# EAGLE design 2LCI2C (EAGLE 9.6.2)
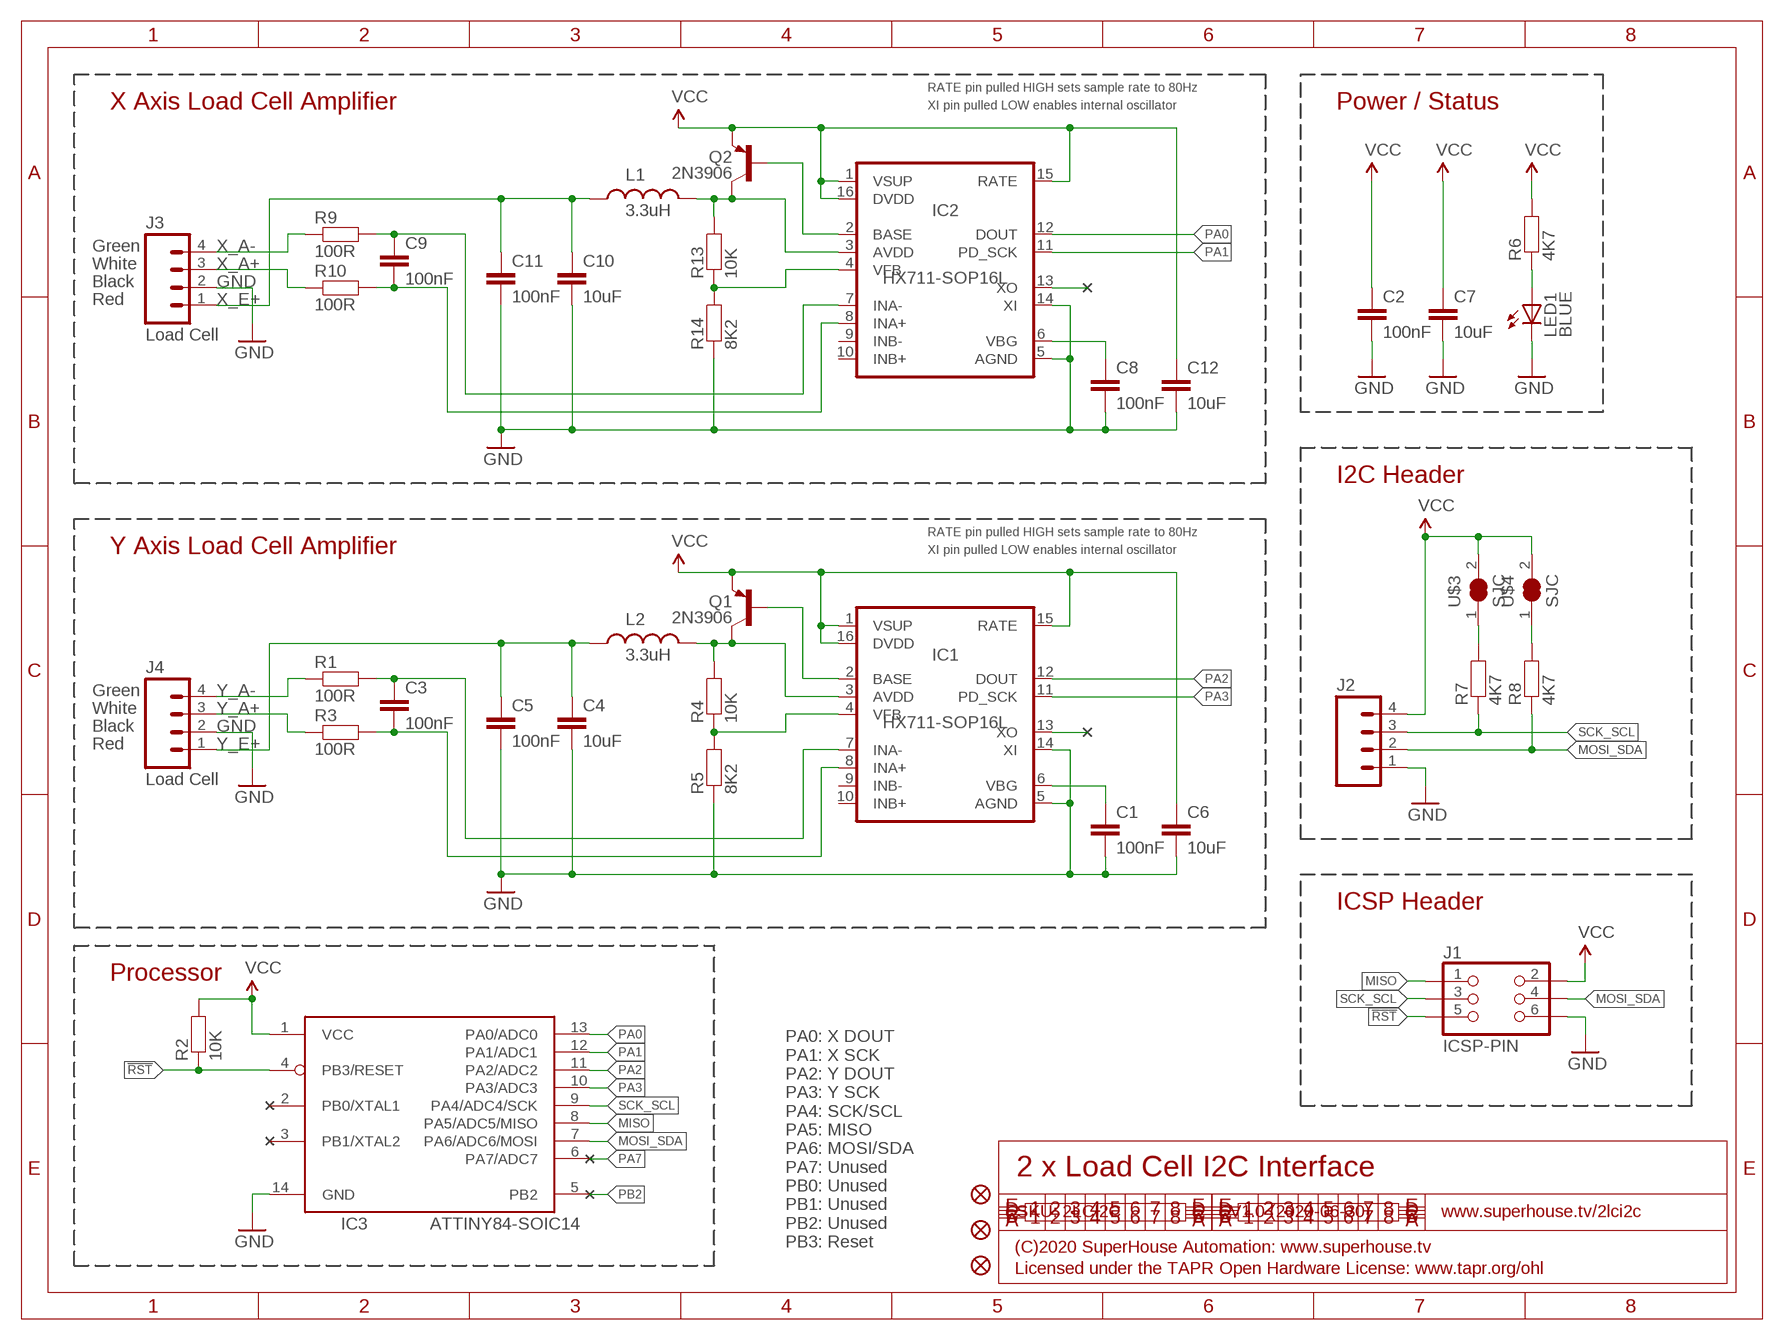
[diagram p0: schematic, sheet 1]

## Parts
C1  100nF  CAP0603  [C0603]
C2  100nF  CAP0603  [C0603]
C3  100nF  CAP0603  [C0603]
C4  10uF  CAP0805  [C0805]
C5  100nF  CAP0603  [C0603]
C6  10uF  CAP0805  [C0805]
C7  10uF  CAP0805  [C0805]
C8  100nF  CAP0603  [C0603]
C9  100nF  CAP0603  [C0603]
C10  10uF  CAP0805  [C0805]
C11  100nF  CAP0603  [C0603]
C12  10uF  CAP0805  [C0805]
IC1  HX711-SOP16L  [SOP16-L]
IC2  HX711-SOP16L  [SOP16-L]
IC3  ATTINY84-SOIC14  [SOIC14]
J1  ICSP-PIN  [2X03-ICSP]
J2  M04-PLAIN  [1X04]
J3  Load Cell  M04-1.27-PLAIN  [1X04-1.27-PLAIN]
J4  Load Cell  M04-1.27-PLAIN  [1X04-1.27-PLAIN]
L1  3.3uH  INDUCTOR0603  [L0603]
L2  3.3uH  INDUCTOR0603  [L0603]
LED1  BLUE  LED0603  [LED-0603]
Q1  2N3906  TRANS_PNPMMBT3906LT1SOT23-BEC  [SOT23-BEC]
Q2  2N3906  TRANS_PNPMMBT3906LT1SOT23-BEC  [SOT23-BEC]
R1  100R  RESISTOR0603  [R0603]
R2  10K  RESISTOR0603  [R0603]
R3  100R  RESISTOR0603  [R0603]
R4  10K  RESISTOR0603  [R0603]
R5  8K2  RESISTOR0603  [R0603]
R6  4K7  RESISTOR0603  [R0603]
R7  4K7  RESISTOR0603  [R0603]
R8  4K7  RESISTOR0603  [R0603]
R9  100R  RESISTOR0603  [R0603]
R10  100R  RESISTOR0603  [R0603]
R13  10K  RESISTOR0603  [R0603]
R14  8K2  RESISTOR0603  [R0603]
U$3  SJC  SJC-NORMAL  [SJC]
U$4  SJC  SJC-NORMAL  [SJC]
U$5  FIDUCIAL1X2.5  [FIDUCIAL-1X2.5]
U$10  FIDUCIAL1X2.5  [FIDUCIAL-1X2.5]
U$11  FIDUCIAL1X2.5  [FIDUCIAL-1X2.5]

## Nets
!RST: IC3.4(PB3/RESET) J1.5 R2.1
GND: C1.2 C2.2 C4.2 C5.2 C6.2 C7.2 C8.2 C10.2 C11.2 C12.2 IC1.5(AGND) IC1.14(XI) IC2.5(AGND) IC2.14(XI) IC3.14(GND) J1.6 J2.1 J3.2 J4.2 LED1.C R5.1 R14.1
MISO: IC3.8(PA5/ADC5/MISO) J1.1
MOSI_SDA: IC3.7(PA6/ADC6/MOSI) J1.4 J2.2 R8.1
N$1: C3.1 IC1.7(INA-) R1.2
N$2: C3.2 IC1.8(INA+) R3.2
N$3: C1.1 IC1.6(VBG)
N$4: IC1.2(BASE) Q1.B
N$5: LED1.A R6.1
N$6: IC1.4(VFB) R4.1 R5.2
N$7: IC1.3(AVDD) L2.2 Q1.C R4.2
N$8: IC2.13(XO)
N$9: IC1.13(XO)
N$11: R7.2 U$3.1
N$12: R8.2 U$4.1
N$14: C9.1 IC2.7(INA-) R9.2
N$15: C9.2 IC2.8(INA+) R10.2
N$16: IC2.3(AVDD) L1.2 Q2.C R13.2
N$17: C8.1 IC2.6(VBG)
N$20: IC2.2(BASE) Q2.B
N$21: IC2.4(VFB) R13.1 R14.2
PA0: IC2.12(DOUT) IC3.13(PA0/ADC0)
PA1: IC2.11(PD_SCK) IC3.12(PA1/ADC1)
PA2: IC1.12(DOUT) IC3.11(PA2/ADC2)
PA3: IC1.11(PD_SCK) IC3.10(PA3/ADC3)
PA7: IC3.6(PA7/ADC7)
PB2: IC3.5(PB2)
SCK_SCL: IC3.9(PA4/ADC4/SCK) J1.3 J2.3 R7.1
VCC: C2.1 C6.1 C7.1 C12.1 IC1.1(VSUP) IC1.15(RATE) IC1.16(DVDD) IC2.1(VSUP) IC2.15(RATE) IC2.16(DVDD) IC3.1(VCC) J1.2 J2.4 Q1.E Q2.E R2.2 R6.2 U$3.2 U$4.2
X_A+: J3.3 R10.1
X_A-: J3.4 R9.1
X_E+: C10.1 C11.1 J3.1 L1.1
Y_A+: J4.3 R3.1
Y_A-: J4.4 R1.1
Y_E+: C4.1 C5.1 J4.1 L2.1
Unconnected: IC1.9(INB-) IC1.10(INB+) IC2.9(INB-) IC2.10(INB+) IC3.2(PB0/XTAL1) IC3.3(PB1/XTAL2)

## Notes on the sheet
- RATE pin pulled HIGH sets sample rate to 80Hz
- X Axis Load Cell Amplifier | XI pin pulled LOW enables internal oscillator | Power / Status
- Green
- White
- Black
- Red
- I2C Header
- RATE pin pulled HIGH sets sample rate to 80Hz
- Y Axis Load Cell Amplifier | XI pin pulled LOW enables internal oscillator
- Green
- White
- Black
- Red
- ICSP Header
- Processor
- 2 x Load Cell I2C Interface
- SKU: 2LCI2C | V1.0 (2020-06-30) | www.superhouse.tv/2lci2c
- PA0: X DOUT
  PA1: X SCK
  PA2: Y DOUT
  PA3: Y SCK
  PA4: SCK/SCL
  PA5: MISO
  PA6: MOSI/SDA
  PA7: Unused
  PB0: Unused
  PB1: Unused
  PB2: Unused
  PB3: Reset
- (C)2020 SuperHouse Automation: www.superhouse.tv
- Licensed under the TAPR Open Hardware License: www.tapr.org/ohl

## Library data of the parts
C1-C12 = SuperHouse-DiscreteSemi:CAP: Capacitor Standard ceramic capacitor
IC1 IC2 = SuperHouse-ICs:HX711: HX711 strain gauge amplifier
IC3 = SuperHouse-MCUs:ATTINY84: ATTiny84
J1 = SuperHouse-Connectors:ICSP
J2-J4 = SuperHouse-Connectors:M04: 4-way header Standard 1x4 header, and screw terminal variations
L1 L2 = SuperHouse-DiscreteSemi:INDUCTOR: Inductors Basic Inductor/Choke - 0603 and 1206. Footprints are not proven and vary greatly between part numbers.
LED1 = SuperHouse-LEDs:LED: LEDs Standard schematic elements and footprints for 5mm, 3mm, 1206, and 0603 sized LEDs. 5mm - Spark Fun Electronics SKU : COM-00529 (and others)
Q1 Q2 = SuperHouse-DiscreteSemi:TRANS_PNP: PNP Transistror
R1-R10 R13 R14 = SuperHouse-DiscreteSemi:RESISTOR: Resistor Standard resistors.
U$3 U$4 = SuperHouse-Jumpers:SJC: Solder jumper. Normally closed: does not need solder to close. Can be opened by cutting the track.
U$5 U$10 U$11 = SuperHouse-Symbols:FIDUCIAL: Fiducial Alignment Points Various fiducial points for machine vision alignment.

## Board
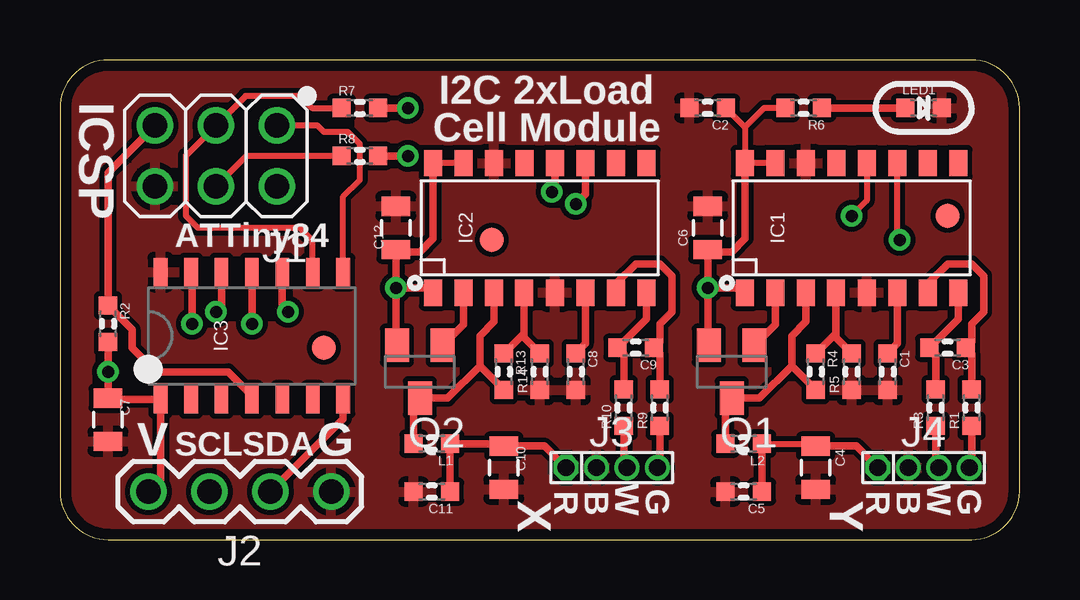
[diagram p1: board, top side]
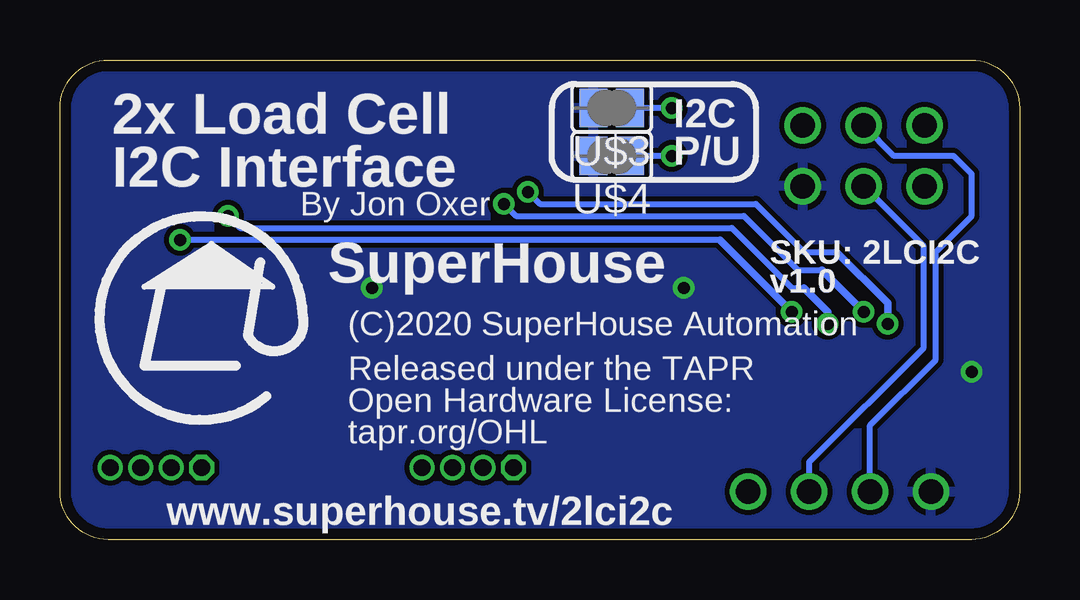
[diagram p2: board, bottom side, seen from below]

Size 40 x 20 mm. Coordinates in mm from the lower left corner, seen from the top.
Outline: 0,18 0,2 arc90 2,0 38,0 arc90 40,2 40,18 arc90 38,20 2,20 arc90 0,18
Copper layers (1*16): Top 0.035mm / dielectric 1.5mm / Bottom 0.035mm
Design rules "SuperHouse-Design-Rules": minimum track width 10mil, minimum drill 24mil, track to track 8mil, track to pad 8mil, pad to pad 8mil, via to via 8mil, smd to smd 6mil, copper to edge 18mil, drill to drill 8mil, minimum pad ring 7mil, minimum via ring 8mil, stop-mask expansion 4mil, vias tented up to drill 0.5mm, thermal gap 10mil

### Footprints (pad centres in the part's own frame; a part is rotated, then mirrored left to right if it is on the bottom)
C0603 = smd 0.762 x 0.762: 1 -0.762,0; 2 0.762,0
C0805 = smd 0.8 x 1.2: 1 -0.9,0; 2 0.9,0
SOP16-L = smd 1.1 x 0.76: 1 -2.7,4.445; 2 -2.7,3.175; 3 -2.7,1.905; 4 -2.7,0.66; 5 -2.7,-0.635; 6 -2.7,-1.905; 7 -2.7,-3.175; 8 -2.7,-4.445; 9 2.7,-4.445; 10 2.7,-3.175; 11 2.7,-1.905; 12 2.7,-0.635; 13 2.7,0.635; 14 2.7,1.905; 15 2.7,3.175; 16 2.7,4.445
SOIC14 = smd 1.18 x 0.58: 1 -2.65,3.81; 2 -2.65,2.54; 3 -2.65,1.27; 4 -2.65,0; 5 -2.65,-1.27; 6 -2.65,-2.54; 7 -2.65,-3.81; 8 2.65,-3.81; 9 2.65,-2.54; 10 2.65,-1.27; 11 2.65,0; 12 2.65,1.27; 13 2.65,2.54; 14 2.65,3.81
2X03-ICSP = drill 1.016: 1 -2.54,-1.27; 2 -2.54,1.27; 3 0,-1.27; 4 0,1.27; 5 2.54,-1.27; 6 2.54,1.27
1X04 = drill 1.016: 1 -3.81,0; 2 -1.27,0; 3 1.27,0; 4 3.81,0
1X04-1.27-PLAIN = drill 0.7 pad 1.016 octagon: 1 -1.905,0 | drill 0.7 pad 1.016: 2 -0.635,0; 3 0.635,0; 4 1.905,0
L0603 = smd 0.762 x 0.762: 1 -0.762,0; 2 0.762,0
LED-0603 = smd 0.762 x 0.762: A -0.762,0; C 0.762,0
SOT23-BEC = smd 1 x 1.4: B -0.95,-1.1; C 0,1.1; E 0.95,-1.1
R0603 = smd 0.762 x 0.762: 1 -0.762,0; 2 0.762,0
SJC = smd 1.168 x 1.6: 1 -0.762,0; 2 0.762,0
FIDUCIAL-1X2.5 = smd 1 x 1: 1 0,0

### Placement (x,y rotation side)
C1  34.5,7 270 top
C2  27,18 180 top
C3  37,8 180 top
C4  31.5,3 270 top
C5  28.5,2 180 top
C6  27,13 90 top
C7  2,5 270 top
C8  21.5,7 270 top
C9  24,8 180 top
C10  18.5,3 270 top
C11  15.5,2 180 top
C12  14,13 90 top
IC1  33,13 90 top
IC2  20,13 90 top
IC3  8,8.5 90 top
J1  6.5,16 180 top
J2  7.5,2 180 top
J3  23,3 0 top
J4  36,3 0 top
L1  15.5,4 180 top
L2  28.5,4 180 top
LED1  36,18 0 top
Q1  28,7 180 top
Q2  15,7 180 top
R1  38,5.5 90 top
R2  2,9 270 top
R3  36.5,5.5 90 top
R4  31.5,7 270 top
R5  33,7 90 top
R6  31,18 180 top
R7  12.5,18 0 top
R8  12.5,16 0 top
R9  25,5.5 90 top
R10  23.5,5.5 90 top
R13  18.5,7 270 top
R14  20,7 90 top
U$3  17,18 180 bottom
U$4  17,16 180 bottom
U$5  37,13.5 0 top
U$10  18,12.5 0 top
U$11  11,8 0 top

### Tracks (layer width: path | path; a pad name or v marks a point on that pad's centre or on a via)
!RST
  Top 0.254: 8,6 IC3.4
  Top 0.305: J1.5 2,15.31 R2.1 3,8.76 3,8 4,7 7,7 8,6
GND
  pour Top: 40,18 40,2 arc-90 38,0 2,0 arc-90 0,2 0,18 arc-90 2,20 38,20 arc-90
MISO
  Top 0.254: IC3.8 11.81,14.31 12.5,15 12.5,16.5 12,17 11,17 10.73,17.27 J1.1
MOSI_SDA
  Top 0.254: R8.1 7.77,16 J1.4
  Top 0.305: IC3.7 11.81,5.04 J2.2
  Bottom 0.254: J2.2 8.77,3.23 4,8 4,12.23 J1.4
N$1
  Top 0.254: 38,7.76 C3.1 38,8.24 | 36.17,10.68 IC1.7
  Top 0.305: 38,7.76 R1.2 | 36.17,10.68 37,11.5 38,11.5 38.5,11 38.5,9.5 38,9 38,8.24
N$2
  Top 0.254: C3.2 36.5,7.74
  Top 0.305: 36.5,7.74 R3.2 | IC1.8 37.45,9.21 C3.2
N$3
  Top 0.305: IC1.6 34.91,8.17 C1.1
N$4
  Top 0.305: IC1.2 29.82,8.97 Q1.B
N$5
  Top 0.305: R6.1 LED1.A
N$6
  Top 0.305: IC1.4 32.34,8.6 | 32.34,8.6 R4.1 | R5.2 32.34,8.42 32.34,8.6
N$7
  Top 0.305: IC1.3 31.09,9.1 30.5,8.5 30.5,7.24 | 30.5,7.24 R4.2 | 30.5,7.24 29.16,5.9 Q1.C 27.74,5.64 L2.2
N$11  (via drill 0.5)
  Top 0.305: R7.2 v14.5,18
  Bottom 0.254: v14.5,18 U$3.1
N$12  (via drill 0.5)
  Top 0.305: v14.5,16 R8.2
  Bottom 0.254: v14.5,16 U$4.1
N$14
  Top 0.254: 25,7.76 C9.1 25,8.24 | 23.18,10.68 IC2.7
  Top 0.305: 25,7.76 R9.2 | 23.18,10.68 24,11.5 25,11.5 25.5,11 25.5,9.5 25,9 25,8.24
N$15
  Top 0.254: C9.2 23.5,7.74
  Top 0.305: 23.5,7.74 R10.2 | IC2.8 24.45,9.21 C9.2
N$16
  Top 0.305: IC2.3 18.09,9.1 17.5,8.5 17.5,7.24 | 17.5,7.24 R13.2 | 17.5,7.24 16.16,5.9 Q2.C 14.74,5.64 L1.2
N$17
  Top 0.305: IC2.6 21.91,8.17 C8.1
N$20
  Top 0.305: Q2.B 16.82,8.97 IC2.2
N$21
  Top 0.305: IC2.4 19.34,8.6 | 19.34,8.6 R13.1 | 19.34,8.6 19.34,8.42 R14.2
PA0  (via drill 0.5)
  Top 0.254: IC3.13 5.5,11.11
  Top 0.305: 5.5,11.11 v5.5,9 | IC2.12 20.64,14.63 v20.5,14.5
  Bottom 0.254: v20.5,14.5 20,14 11,14 9,12 7.64,12
  Bottom 0.305: v5.5,9 5.5,9.86 7.64,12
PA1  (via drill 0.5)
  Top 0.305: IC3.12 6.73,9.73 v6.5,9.5 | v21.5,14 21.91,14.4 IC2.11
  Bottom 0.254: v21.5,14 21,13.5 11.5,13.5 9.25,11.25 8.25,11.25
  Bottom 0.305: 8.25,11.25 v6.5,9.5
PA2  (via drill 0.5)
  Top 0.254: IC1.12 33.63,14.13 v33,13.5
  Top 0.305: IC3.11 v8,9
  Bottom 0.254: v33,13.5 32.5,13 12,13 9.5,10.5 9,10.5
  Bottom 0.305: 9,10.5 8,9.5 v8,9
PA3  (via drill 0.5)
  Top 0.254: v35,12.5 34.91,12.6 IC1.11
  Top 0.305: IC3.10 9.27,9.73 v9.5,9.5
  Bottom 0.254: 12.5,12.5 v35,12.5
  Bottom 0.305: v9.5,9.5 12.5,12.5
SCK_SCL
  Top 0.254: IC3.9 10.54,12.46 10,13 5.75,13 5.25,13.5 5.25,16.02 J1.3 7.73,18.5 10,18.5 10.5,18 R7.1
  Bottom 0.254: J2.3 6.23,4.77 3.5,7.5 3.5,12 2,13.5 2,15.25 2.75,16 5.23,16 J1.3
VCC  (via drill 0.5)
  Top 0.254: 15.36,10.5 IC2.1 | C2.1 28.55,17.21 | 28.55,17.21 IC1.16 IC1.15 | R6.2 29.35,18 28.55,17.21 | 2.55,5.85 C7.1 | IC2.15 IC2.16
  Top 0.305: v14,10.5 C12.1 14.1,12 15,12 15.55,12.55 IC2.16 | v14,10.5 15.36,10.5 | Q2.E 14,8.15 v14,10.5 | v27,10.5 C6.1 27.1,12 28,12 28.55,12.55 IC1.16 | v27,10.5 28.36,10.5 IC1.1 | Q1.E 27,8.15 v27,10.5 | R2.2 v2,7 C7.1 | J2.4 4.19,2.5 IC3.1 2.55,5.85
  pour Bottom: 40,18 40,2 arc-90 38,0 2,0 arc-90 0,2 0,18 arc-90 2,20 38,20 arc-90
X_A+
  Top 0.305: R10.1 23.5,3.13 J3.3
X_A-
  Top 0.305: R9.1 25,3.1 J3.4
X_E+
  Top 0.254: 18.4,4 C10.1
  Top 0.305: C11.1 L1.1 18.4,4 | C10.1 20.2,3.9 J3.1
Y_A+
  Top 0.305: R3.1 36.5,3.13 J4.3
Y_A-
  Top 0.305: R1.1 38,3.1 J4.4
Y_E+
  Top 0.254: L2.1 31.4,4 C4.1
  Top 0.305: L2.1 C5.1 | C4.1 33.2,3.9 J4.1

### Text on the board
tPlace: I2C 2xLoad / Cell Module | ICSP | ATTiny84 | V | SCL | SDA | G | R | B | W | G | R | B | W | G | X | Y
bPlace: I2C / P/U | 2x Load Cell / I2C Interface | By Jon Oxer | SKU: 2LCI2C | SuperHouse | v1.0 | (C)2020 SuperHouse Automation | Released under the TAPR / Open Hardware License: / tapr.org/OHL | www.superhouse.tv/2lci2c